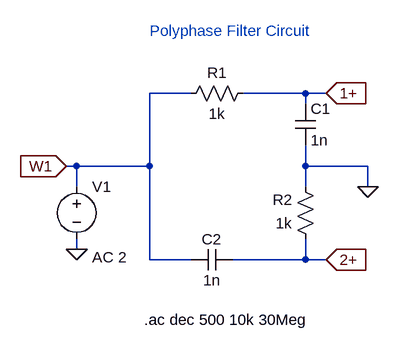
[diagram p0: schematic simp_first_order_pf_ltspice.asc]
simp_first_order_pf_ltspice.asc, the LTspice schematic file:
Version 4
SHEET 1 880 680
WIRE 96 160 32 160
WIRE 272 160 176 160
WIRE 304 160 272 160
WIRE 272 176 272 160
WIRE -80 272 -96 272
WIRE 32 272 32 160
WIRE 32 272 -80 272
WIRE 272 272 272 240
WIRE 368 272 272 272
WIRE -80 304 -80 272
WIRE 272 304 272 272
WIRE 368 304 368 272
WIRE -80 400 -80 384
WIRE 32 416 32 272
WIRE 96 416 32 416
WIRE 272 416 272 384
WIRE 272 416 160 416
WIRE 304 416 272 416
FLAG -80 400 0
FLAG 368 304 0
FLAG 304 160 1+
IOPIN 304 160 In
FLAG 304 416 2+
IOPIN 304 416 In
FLAG -96 272 W1
IOPIN -96 272 In
SYMBOL voltage -80 288 R0
WINDOW 123 24 124 Left 2
WINDOW 39 0 0 Left 0
SYMATTR InstName V1
SYMATTR Value ""
SYMATTR Value2 AC 2
SYMBOL res 192 144 R90
WINDOW 0 0 56 VBottom 2
WINDOW 3 32 56 VTop 2
SYMATTR InstName R1
SYMATTR Value 1k
SYMBOL res 288 400 R180
WINDOW 0 36 76 Left 2
WINDOW 3 36 40 Left 2
SYMATTR InstName R2
SYMATTR Value 1k
SYMBOL cap 256 176 R0
SYMATTR InstName C1
SYMATTR Value 1n
SYMBOL cap 160 400 R90
WINDOW 0 0 32 VBottom 2
WINDOW 3 32 32 VTop 2
SYMATTR InstName C2
SYMATTR Value 1n
TEXT 32 64 Left 2 ;Polyphase Filter Circuit
TEXT 24 508 Left 2 !.ac dec 500 10k 30Meg

The netlist it stands for:
* simp_first_order_pf_ltspice.asc
V1 W1 0 AC 2
R1 1+ W1 1k
R2 2+ 0 1k
C1 1+ 0 1n
C2 2+ W1 1n
* Polyphase Filter Circuit
.ac dec 500 10k 30Meg
.backanno
.end